# EAGLE schematic microcontroller (EAGLE 6.6.0)
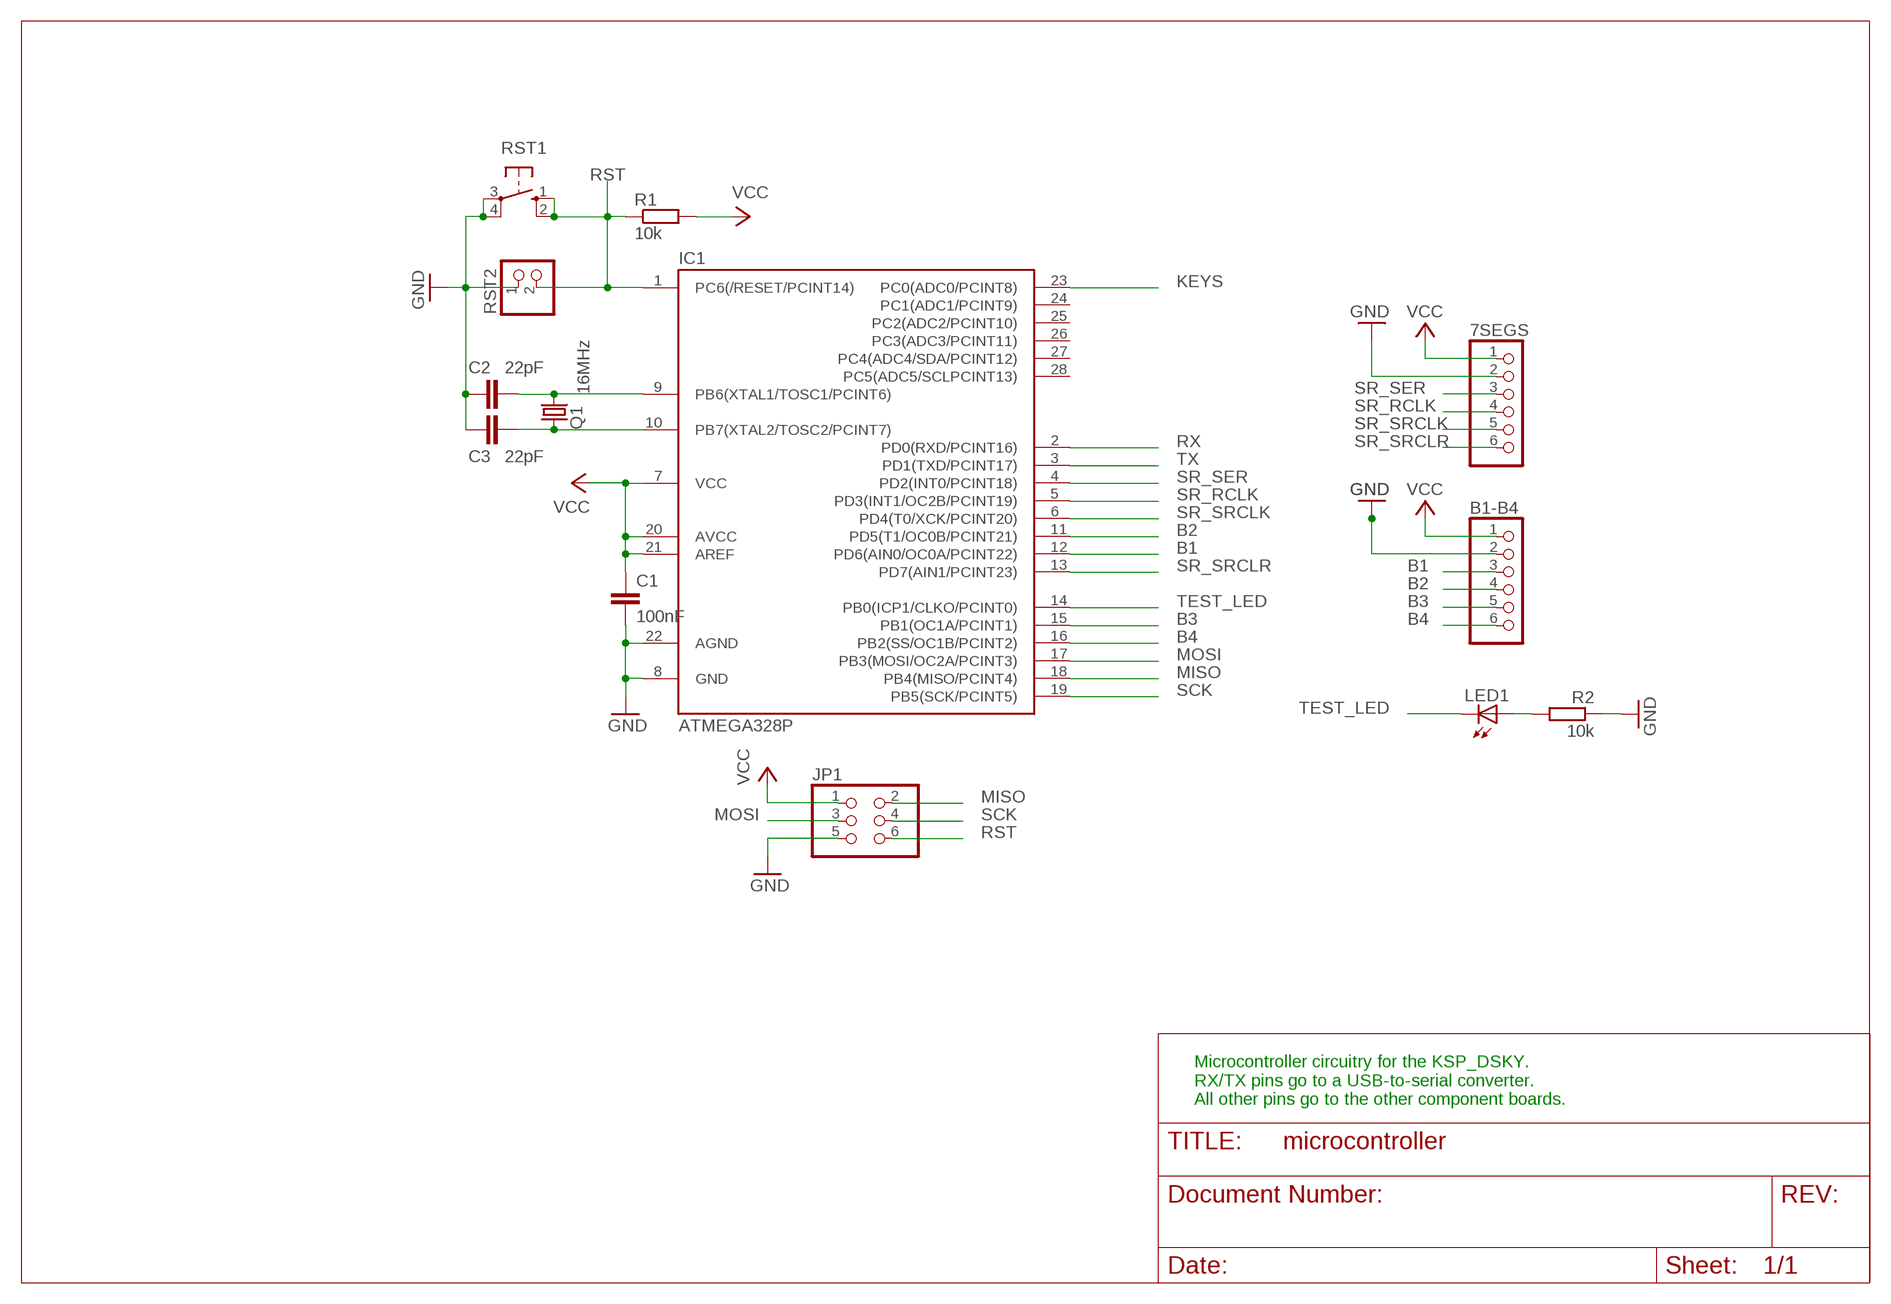
[diagram p0: schematic, sheet 1]

## Parts
7SEGS  PINHD-1X6  [1X06]
B1-B4  PINHD-1X6  [1X06]
C1  100nF  C-EU025-024X044  [C025-024X044]
C2  22pF  C-EU025-024X044  [C025-024X044]
C3  22pF  C-EU025-024X044  [C025-024X044]
IC1  ATMEGA328P  MEGA48/88/168-PU  [DIL28-3]
JP1  PINHD-2X3  [2X03]
LED1  LED3MM  [LED3MM]
Q1  16MHz  CRYSTALHC49U-V  [HC49U-V]
R1  10k  R-EU_0207/10  [0207/10]
R2  10k  R-EU_0207/10  [0207/10]
RST1  10-XX  [B3F-10XX]
RST2  PINHD-1X2  [1X02]

## Nets
B1: B1-B4.3 IC1.12(PD6(AIN0/OC0A/PCINT22))
B2: B1-B4.4 IC1.11(PD5(T1/OC0B/PCINT21))
B3: B1-B4.5 IC1.15(PB1(OC1A/PCINT1))
B4: B1-B4.6 IC1.16(PB2(SS/OC1B/PCINT2))
GND: 7SEGS.2 B1-B4.2 C1.2 C2.1 C3.1 IC1.8(GND) IC1.22(AGND) JP1.5 R2.1 RST1.3(P) RST1.4(P1) RST2.1
KEYS: IC1.23(PC0(ADC0/PCINT8))
MISO: IC1.18(PB4(MISO/PCINT4)) JP1.2
MOSI: IC1.17(PB3(MOSI/OC2A/PCINT3)) JP1.3
N$1: C2.2 IC1.9(PB6(XTAL1/TOSC1/PCINT6)) Q1.2
N$2: LED1.A R2.2
N$6: C3.2 IC1.10(PB7(XTAL2/TOSC2/PCINT7)) Q1.1
RST: IC1.1(PC6(/RESET/PCINT14)) JP1.6 R1.1 RST1.1(S) RST1.2(S1) RST2.2
RX: IC1.2(PD0(RXD/PCINT16))
SCK: IC1.19(PB5(SCK/PCINT5)) JP1.4
SR_RCLK: 7SEGS.4 IC1.5(PD3(INT1/OC2B/PCINT19))
SR_SER: 7SEGS.3 IC1.4(PD2(INT0/PCINT18))
SR_SRCLK: 7SEGS.5 IC1.6(PD4(T0/XCK/PCINT20))
SR_SRCLR: 7SEGS.6 IC1.13(PD7(AIN1/PCINT23))
TEST_LED: IC1.14(PB0(ICP1/CLKO/PCINT0)) LED1.K(C)
TX: IC1.3(PD1(TXD/PCINT17))
VCC: 7SEGS.1 B1-B4.1 C1.1 IC1.7(VCC) IC1.20(AVCC) IC1.21(AREF) JP1.1 R1.2
Unconnected: IC1.24(PC1(ADC1/PCINT9)) IC1.25(PC2(ADC2/PCINT10)) IC1.26(PC3(ADC3/PCINT11)) IC1.27(PC4(ADC4/SDA/PCINT12)) IC1.28(PC5(ADC5/SCLPCINT13))

## Notes on the sheet
- Microcontroller circuitry for the KSP_DSKY.
  RX/TX pins go to a USB-to-serial converter.
  All other pins go to the other component boards.

## Library data of the parts
7SEGS B1-B4 = pinhead:PINHD-1X6: PIN HEADER
C1-C3 = rcl:C-EU: CAPACITOR, European symbol
IC1 = avr-6:MEGA48/88/168-PU
JP1 = pinhead:PINHD-2X3: PIN HEADER
LED1 = led:LED: LED OSRAM: - CHIPLED LG R971, LG N971, LY N971, LG Q971, LY Q971, LO R971, LY R971 LH N974, LH R974 LS Q976, LO Q976, LY Q976 LO Q996 - Hyper CHIPLED LW Q18S LB Q993, LB Q99A, LB R99A - SideLED LS A670, LO A670, LY A670, LG A670, LP A670 LB A673, LV A673, LT A673, LW A673 LH A674 LY A675 LS A676, LA A676, LO A676, LY A676, LW A676 LS A679, LY A679, LG A679 - Hyper Micro SIDELED® LS Y876, LA Y876, LO Y876, LY Y876 LT Y87S - SmartLED LW L88C, LW L88S LB L89C, LB L89S, LG L890 LS L89K, LO L89K, LY L89K LS L896, LA L896, LO L896, LY L896 - TOPLED LS T670, LO T670, LY T670, LG T670, LP T670 LSG T670, LSP T670, LSY T670, LOP T670, LYG T670 LG T671, LOG T671, LSG T671 LB T673, LV T673, LT T673, LW T673 LH T674 LS T676, LA T676, LO T676, LY T676, LB T676, LH T676, LSB T676, LW T676 LB T67C, LV T67C, LT T67C, LS T67K, LO T67K, LY T67K, LW E67C LS E67B, LA E67B, LO E67B, LY E67B, LB E67C, LV E67C, LT E67C LW T67C LS T679, LY T679, LG T679 LS T770, LO T770, LY T770, LG T770, LP T770 LB T773, LV T773, LT T773, LW T773 LH T774 LS E675, LA E675, LY E675, LS T675 LS T776, LA T776, LO T776, LY T776, LB T776 LHGB T686 LT T68C, LB T68C - Hyper Mini TOPLED® LB M676 - Mini TOPLED Santana® LG M470 LS M47K, LO M47K, LY M47K Source: http://www.osram.convergy.de LUXEON: - LUMILED® LXK2-PW12-R00, LXK2-PW12-S00, LXK2-PW14-U00, LXK2-PW14-V00 LXK2-PM12-R00, LXK2-PM12-S00, LXK2-PM14-U00 LXK2-PE12-Q00, LXK2-PE12-R00, LXK2-PE12-S00, LXK2-PE14-T00, LXK2-PE14-U00 LXK2-PB12-K00, LXK2-PB12-L00, LXK2-PB12-M00, LXK2-PB14-N00, LXK2-PB14-P00, LXK2-PB14-Q00 LXK2-PR12-L00, LXK2-PR12-M00, LXK2-PR14-Q00, LXK2-PR14-R00 LXK2-PD12-Q00, LXK2-PD12-R00, LXK2-PD12-S00 LXK2-PH12-R00, LXK2-PH12-S00 LXK2-PL12-P00, LXK2-PL12-Q00, LXK2-PL12-R00 Source: www.luxeon.com KINGBRIGHT: KA-3528ASYC Source: www.kingbright.com
Q1 = crystal:CRYSTAL: CRYSTAL; OC_FARNELL: 1666969; OC_NEWARK: unknown
R1 R2 = rcl:R-EU_: RESISTOR, European symbol
RST1 = switch-omron:10-XX: OMRON SWITCH; MPN: B3F-1000; OC_FARNELL: 176432; OC_NEWARK: 36M3542
RST2 = pinhead:PINHD-1X2: PIN HEADER